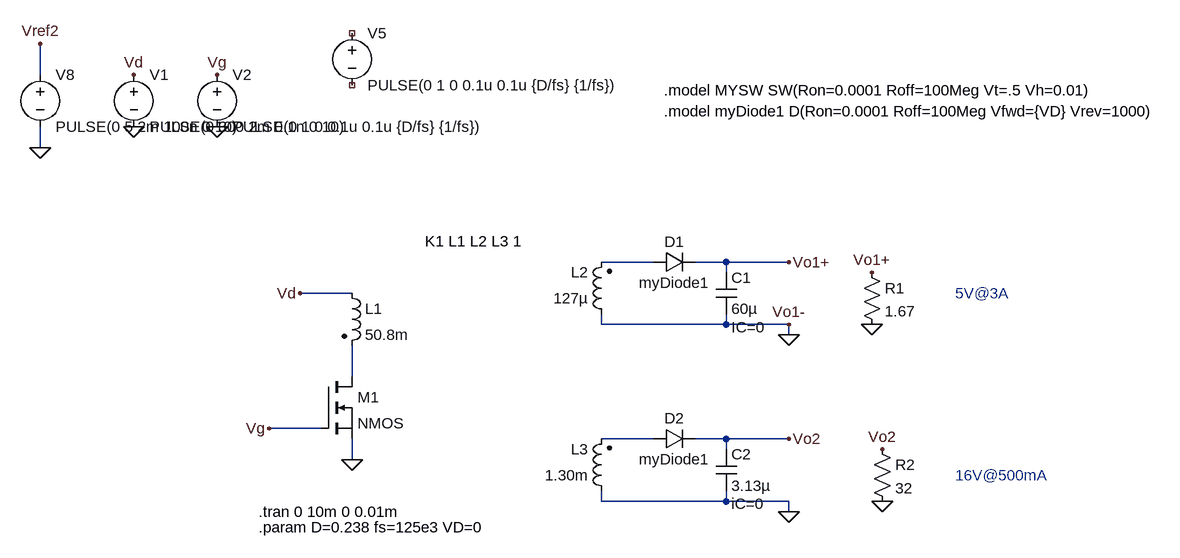
[diagram p0: schematic ModeloReal.asc]
ModeloReal.asc, the LTspice schematic file:
Version 4
SHEET 1 2496 3908
WIRE -240 -192 -240 -240
WIRE -240 -80 -240 -112
WIRE 704 96 624 96
WIRE 816 96 768 96
WIRE 912 96 816 96
WIRE 816 112 816 96
WIRE 240 144 160 144
WIRE 624 192 624 176
WIRE 816 192 816 176
WIRE 816 192 624 192
WIRE 912 192 816 192
WIRE 912 208 912 192
WIRE 240 272 240 224
WIRE 192 352 112 352
WIRE 704 368 624 368
WIRE 816 368 768 368
WIRE 912 368 816 368
WIRE 816 384 816 368
WIRE 240 400 240 368
WIRE 624 464 624 448
WIRE 816 464 816 448
WIRE 816 464 624 464
WIRE 912 464 816 464
WIRE 912 480 912 464
FLAG -96 -112 0
FLAG -96 -192 Vd
FLAG 160 144 Vd
FLAG 912 96 Vo1+
FLAG 32 -112 0
FLAG 32 -192 Vg
FLAG 912 368 Vo2
FLAG 912 480 0
FLAG 912 192 Vo1-
FLAG 912 208 0
FLAG 1040 112 Vo1+
FLAG 1040 192 0
FLAG 1056 384 Vo2
FLAG 1056 464 0
FLAG 240 400 0
FLAG 112 352 Vg
FLAG -240 -80 0
FLAG -240 -240 Vref2
SYMBOL ind2 640 192 R180
WINDOW 0 36 80 Left 2
WINDOW 3 36 40 Left 2
SYMATTR InstName L2
SYMATTR Value 127µ
SYMATTR Type ind
SYMBOL ind2 224 128 R0
SYMATTR InstName L1
SYMATTR Value 50.8m
SYMATTR Type ind
SYMBOL voltage -96 -208 R0
WINDOW 123 0 0 Left 0
WINDOW 39 0 0 Left 0
SYMATTR InstName V1
SYMATTR Value PULSE(0 300 2m 0.1n 0 10)
SYMBOL voltage 32 -208 R0
WINDOW 123 0 0 Left 0
WINDOW 39 0 0 Left 0
SYMATTR InstName V2
SYMATTR Value PULSE(0 1 0 0.1u 0.1u {D/fs} {1/fs})
SYMBOL ind2 640 464 R180
WINDOW 0 36 80 Left 2
WINDOW 3 36 40 Left 2
SYMATTR InstName L3
SYMATTR Value 1.30m
SYMATTR Type ind
SYMBOL diode 704 112 R270
WINDOW 0 32 32 VTop 2
WINDOW 3 0 32 VBottom 2
SYMATTR InstName D1
SYMATTR Value myDiode1
SYMBOL diode 704 384 R270
WINDOW 0 32 32 VTop 2
WINDOW 3 0 32 VBottom 2
SYMATTR InstName D2
SYMATTR Value myDiode1
SYMBOL cap 800 112 R0
WINDOW 123 24 84 Left 2
SYMATTR Value2 IC=0
SYMATTR InstName C1
SYMATTR Value 60µ
SYMBOL cap 800 384 R0
WINDOW 123 24 84 Left 2
SYMATTR Value2 iC=0
SYMATTR InstName C2
SYMATTR Value 3.13µ
SYMBOL res 1024 96 R0
SYMATTR InstName R1
SYMATTR Value 1.67
SYMBOL res 1040 368 R0
SYMATTR InstName R2
SYMATTR Value 32
SYMBOL nmos 192 272 R0
SYMATTR InstName M1
SYMBOL voltage -240 -208 R0
WINDOW 123 0 0 Left 0
WINDOW 39 0 0 Left 0
SYMATTR InstName V8
SYMATTR Value PULSE(0 5 2m 100n 0 10)
SYMBOL voltage 240 -272 R0
WINDOW 123 0 0 Left 0
WINDOW 39 0 0 Left 0
SYMATTR InstName V5
SYMATTR Value PULSE(0 1 0 0.1u 0.1u {D/fs} {1/fs})
TEXT 352 64 Left 2 !K1 L1 L2 L3 1
TEXT 96 480 Left 2 !.tran 0 10m 0 0.01m
TEXT 96 504 Left 2 !.param D=0.238 fs=125e3 VD=0
TEXT 720 -168 Left 2 !.model MYSW SW(Ron=0.0001 Roff=100Meg Vt=.5 Vh=0.01)
TEXT 720 -136 Left 2 !.model myDiode1 D(Ron=0.0001 Roff=100Meg Vfwd={VD} Vrev=1000)
TEXT 1168 144 Left 2 ;5V@3A
TEXT 1168 424 Left 2 ;16V@500mA

The netlist it stands for:
* ModeloReal.asc
L2 0 N001 127µ
L1 Vd N002 50.8m
V1 Vd 0 PULSE(0 300 2m 0.1n 0 10)
V2 Vg 0 PULSE(0 1 0 0.1u 0.1u {D/fs} {1/fs})
L3 0 N003 1.30m
D1 N001 Vo1+ myDiode1
D2 N003 Vo2 myDiode1
C1 Vo1+ 0 60µ IC=0
C2 Vo2 0 3.13µ iC=0
R1 Vo1+ 0 1.67
R2 Vo2 0 32
M1 N002 Vg 0 0 NMOS
V8 Vref2 0 PULSE(0 5 2m 100n 0 10)
V5 NC_01 NC_02 PULSE(0 1 0 0.1u 0.1u {D/fs} {1/fs})
.model D D
.lib standard.dio
.model NMOS NMOS
.model PMOS PMOS
.lib standard.mos
K1 L1 L2 L3 1
.tran 0 10m 0 0.01m
.param D=0.238 fs=125e3 VD=0
.model MYSW SW(Ron=0.0001 Roff=100Meg Vt=.5 Vh=0.01)
.model myDiode1 D(Ron=0.0001 Roff=100Meg Vfwd={VD} Vrev=1000)
* 5V@3A
* 16V@500mA
.backanno
.end